# EAGLE design robot_large (EAGLE 6.4)
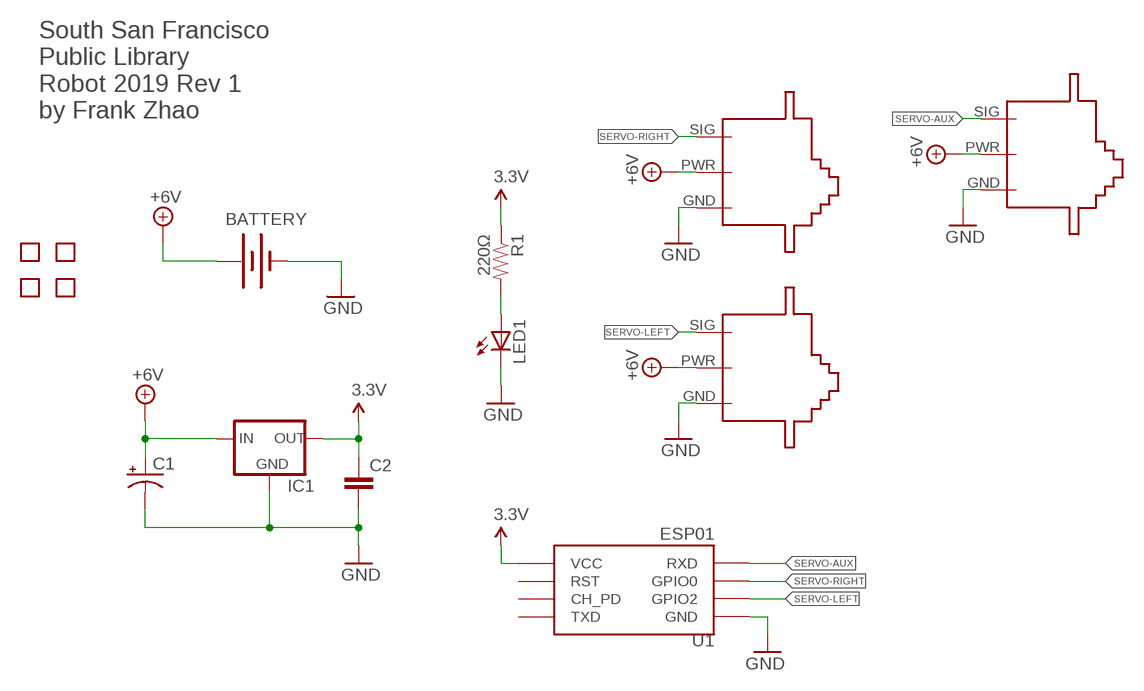
[diagram p0: schematic, sheet 1]

## Parts
BATTERY  BATTERY-WIRE-CONN  [BATT-WIRE-CONN]
C1  CAP_POLPTH1  [CPOL-RADIAL-100UF-25V]
C2  CAPPTH  [CAP-PTH-SMALL]
IC1  V_REG_78XXTO-92  [TO-92]
LED1  LED5MM  [LED5MM]
M1  SERVO-FLIPPED  [SERVO-FLIPPED]
M2  SERVO-1  [SERVO]
M3  SERVO-1  [SERVO]
R1  220Ω  RESISTORAXIAL-0.3-NOVAL  [AXIAL-0.3-NOVAL]
U1  ESP01  [ESP01]
U$9  TEXT-INFO  [TEXT-INFO]
U$10  HOLE  [HOLE-2MM]
U$11  HOLE  [HOLE-2MM]
U$12  HOLE  [HOLE-2MM]
U$13  HOLE  [HOLE-2MM]

## Nets
3.3V: C2.1 IC1.3(OUT) R1.P$1 U1.VCC
+6V: BATTERY.POS(+) C1.1(+) IC1.2(IN) M1.PWR M2.PWR M3.PWR
GND: BATTERY.NEG(-) C1.2(-) C2.2 IC1.1(GND) LED1.K(C) M1.GND M2.GND M3.GND U1.GND
N$9: LED1.A R1.P$2
SERVO-AUX: M3.SIG U1.RX(RXD)
SERVO-LEFT: M1.SIG U1.GPIO2
SERVO-RIGHT: M2.SIG U1.GPIO0
Unconnected: U1.CH_PD U1.RST U1.TX(TXD)

## Library data of the parts
BATTERY = robot:BATTERY: Battery Holders Various common sizes : AA, AAA, 20mm coin cell and 12mm coin cell.
C1 = robot:CAP_POL: Capacitor Polarized These are standard SMD and PTH capacitors. Normally 10uF, 47uF, and 100uF in electrolytic and tantalum varieties. Always verify the external diameter of the through hole cap, it varies with capacity, voltage, and manufacturer. The EIA devices should be standard.
C2 = robot:CAP: Capacitor Standard 0603 ceramic capacitor, and 0.1" leaded capacitor.
IC1 = robot:V_REG_78XX: Voltage Regulator Standard 7805 5V regulator. IGO (Input Ground Output). Spark Fun Electronics SKU : COM-00107
LED1 = robot:LED: LEDs Standard schematic elements and footprints for 5mm, 3mm, 1206, and 0603 sized LEDs. 5mm - Spark Fun Electronics SKU : COM-00529 (and others)
M1-M3 = robot:SERVO
R1 = robot:RESISTOR: Resistor Basic schematic elements and footprints for 0603, 1206, and PTH resistors.
U1 = robot:ESP01: ESP8266 Wifi module 01
U$9 = robot:TEXT-INFO
U$10-U$13 = robot:HOLE

## Board
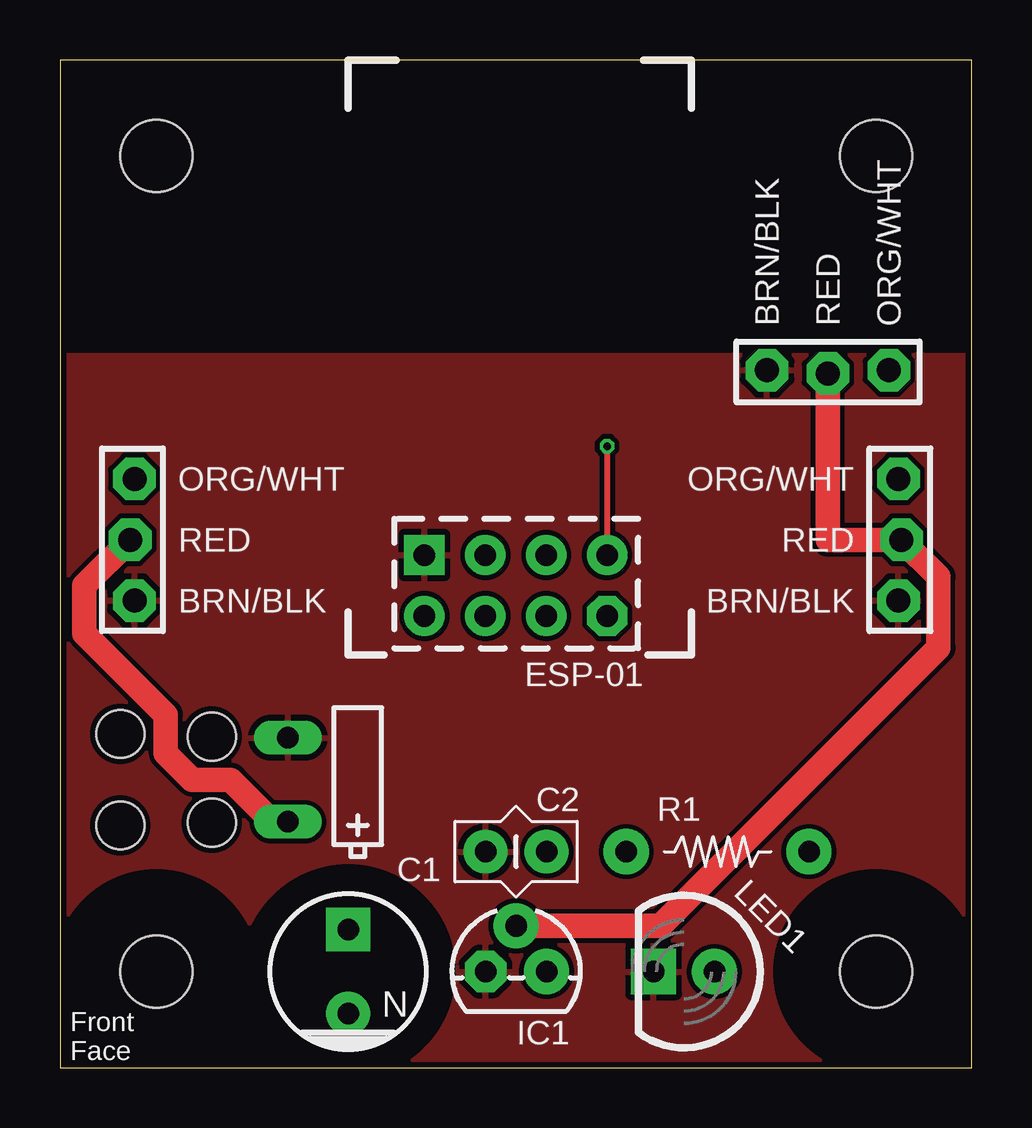
[diagram p1: board, top side]
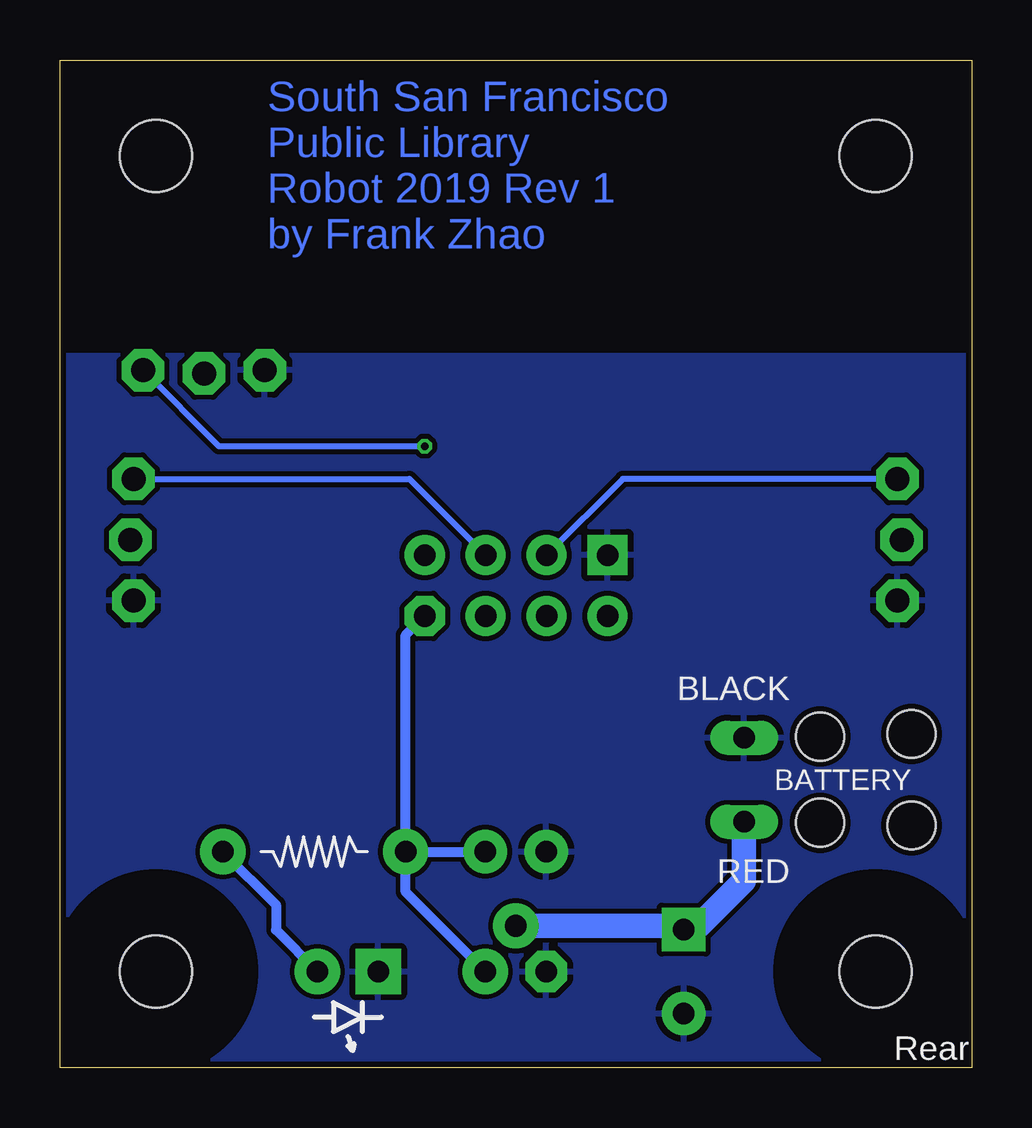
[diagram p2: board, bottom side, seen from below]

Size 38 x 42 mm. Coordinates in mm from the lower left corner, seen from the top.
Outline: 0,0 38,0 38,42 0,42 0,0
Copper layers (1*16): Top 0.035mm / dielectric 1.5mm / Bottom 0.035mm
Design rules "Fusion_eagle_rule_v1.1_TentedVias3": minimum track width 6mil, minimum drill 0.3mm, track to track 7mil, track to pad 7mil, pad to pad 7mil, via to via 7mil, smd to smd 0mil, copper to edge 10mil, drill to drill 10mil, minimum pad ring 10mil, minimum via ring 6mil, stop-mask expansion 2mil, vias tented up to drill 25mil, thermal gap 10mil
tRestrict: 1 lines
bRestrict: 2 lines

### Footprints (pad centres in the part's own frame; a part is rotated, then mirrored left to right if it is on the bottom)
BATT-WIRE-CONN = drill 0.9 long: NEG -6.985,-1.75; POS -6.985,1.75 | hole 2: 0,1.905; 0,-1.905; -3.81,1.8; -3.81,-1.8
CPOL-RADIAL-100UF-25V = drill 0.9 pad 1.829 square: 1 1.75,0 | drill 0.9 pad 1.829: 2 -1.75,0
CAP-PTH-SMALL = drill 0.9 pad 1.829: 1 -1.27,0; 2 1.27,0
TO-92 = drill 0.9 pad 1.727 octagon: 1 -1.27,0 | drill 0.9 pad 1.88: 2 0,1.905; 3 1.27,0
LED5MM = drill 0.9 pad 1.88: A -1.27,0 | drill 0.9 pad 1.88 square: K 1.27,0
SERVO-FLIPPED = drill 1 pad 1.778 octagon: GND 2.54,0.089; PWR 0,-0.089; SIG -2.54,0.089
SERVO = drill 1 pad 1.778 octagon: GND -2.54,0.064; PWR 0,-0.064; SIG 2.54,0.064
AXIAL-0.3-NOVAL = drill 0.9 pad 1.88: P$1 -3.81,0; P$2 3.81,0
ESP01 = drill 0.9 pad 1.676: CH_PD -1.285,-8.178; GPIO0 1.255,-5.638; GPIO2 -1.285,-5.638; RST 1.255,-8.178; RX 3.795,-5.638; TX -3.825,-8.178 | drill 0.9 pad 1.676 square: GND -3.825,-5.638 | drill 0.9 pad 1.676 octagon: VCC 3.795,-8.178
HOLE-2MM = hole 3: 0,0

### Placement (x,y rotation side)
BATTERY  2.5,12 180 top
C1  12,4 90 top
C2  19,9 180 top
IC1  19,4 0 top
LED1  26,4 180 top
M1  3,22 270 top
M2  35,22 90 top
M3  32,29 0 top
R1  27.4,9 0 top
U1  19,27 0 top
U$9  30,33.5 0 bottom
U$10  4,4 0 top
U$11  4,38 0 bottom
U$12  34,4 0 bottom
U$13  34,38 0 top

### Tracks (layer width: path | path; a pad name or v marks a point on that pad's centre or on a via)
3.3V
  Bottom 0.406: IC1.3 23.59,7.32 R1.P$1 | R1.P$1 C2.1 | R1.P$1 23.59,18.03 U1.VCC
+6V
  Top 1.016: BATTERY.POS 8.85,10.25 7.1,12 5.5,12 4.4,13.1 4.4,14.7 1,18.1 1,20.09 M1.PWR | IC1.2 25,5.91 36.6,17.5 36.6,20.46 M2.PWR 32,22 M3.PWR
  Bottom 1.016: BATTERY.POS 9.48,7.79 11.37,5.91 12,5.91 | 12,5.91 IC1.2 | C1.1 12,5.91
GND
  pour Bottom (isolate 0.203): 0,0 38,0 38,42 0,42
  pour Top (isolate 0.203): 0,0 38,0 38,42 0,42
N$9
  Bottom 0.406: R1.P$2 29,6.79 29,5.73 LED1.A
SERVO-AUX  (via drill 0.3)
  Top 0.254: v22.8,25.9 U1.RX
  Bottom 0.254: M3.SIG 31.38,25.9 v22.8,25.9
SERVO-LEFT
  Bottom 0.254: M1.SIG 14.54,24.54 U1.GPIO2
SERVO-RIGHT
  Bottom 0.254: M2.SIG 23.43,24.54 U1.GPIO0

### Text on the board
tPlace: N | Front / Face
bPlace: Rear
tNames: ESP-01